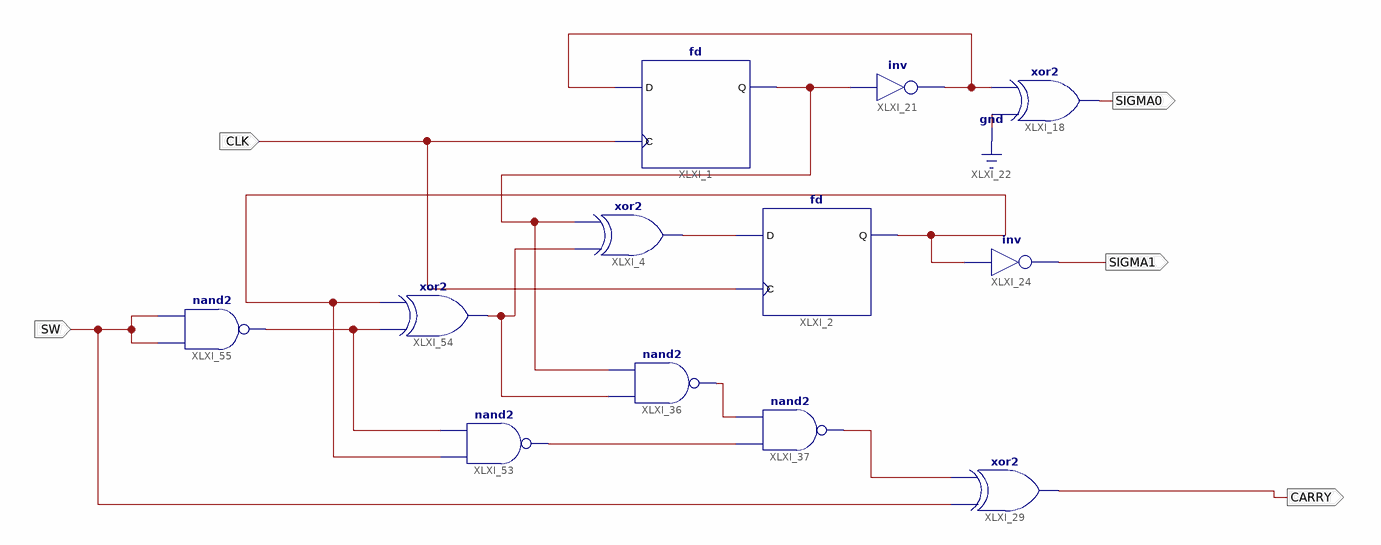
[diagram p0: schematic sheet 1]
// Xilinx ISE schematic UPDOWN_CNT2.sch (spartan6) as structural Verilog: 12 symbols, 5 ports
module UPDOWN_CNT2 (
  input  CLK,
  input  SW,
  output CARRY,
  output SIGMA0,
  output SIGMA1
);

  wire SI, SIG, XLXN_5, XLXN_12, XLXN_33, XLXN_68, XLXN_79, XLXN_113, XLXN_120;

  fd XLXI_2 (.C(CLK), .D(XLXN_5), .Q(SIG));
  xor XLXI_4 (XLXN_5, XLXN_33, SI);
  fd XLXI_1 (.C(CLK), .D(XLXN_68), .Q(SI));
  xor XLXI_18 (SIGMA0, 1'b0, XLXN_68);
  not XLXI_21 (XLXN_68, SI);
  xor XLXI_29 (CARRY, SW, XLXN_79);
  nand XLXI_36 (XLXN_12, XLXN_33, SI);
  nand XLXI_37 (XLXN_79, XLXN_113, XLXN_12);
  not XLXI_24 (SIGMA1, SIG);
  nand XLXI_53 (XLXN_113, SIG, XLXN_120);
  xor XLXI_54 (XLXN_33, XLXN_120, SIG);
  nand XLXI_55 (XLXN_120, SW, SW);
endmodule
